# Altium schematic sheet [04] - LEVEL_SHIFTER.SchDoc
size Letter
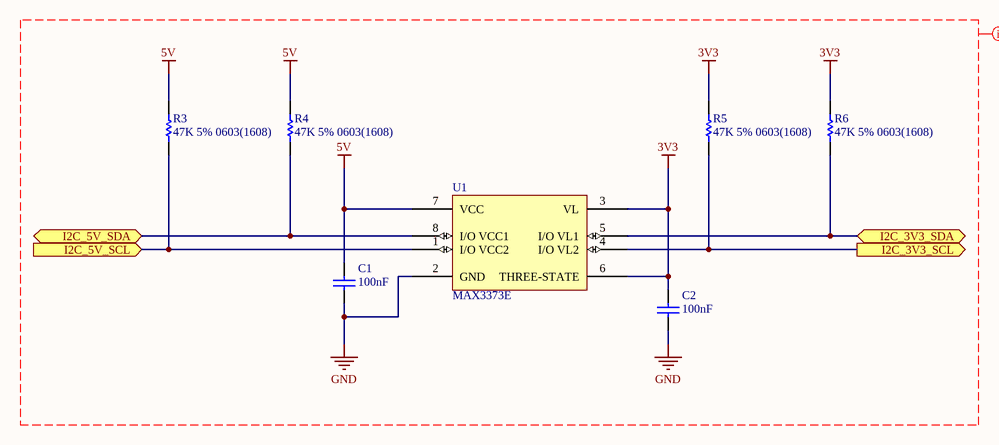
[diagram p0: [04] - LEVEL_SHIFTER.SchDoc]

## Parts
C1  value 100nF  [CAPC0603(1608)100_L]  (hidden comment: CAP 100nF 50V 0603(1608))
C2  value 100nF  [CAPC0603(1608)100_L]  (hidden comment: CAP 100nF 50V 0603(1608))
R3  47K 5% 0603(1608)  [RESC0603(1608)_L]
R4  47K 5% 0603(1608)  [RESC0603(1608)_L]
R5  47K 5% 0603(1608)  [RESC0603(1608)_L]
R6  47K 5% 0603(1608)  [RESC0603(1608)_L]
U1  MAX3373E  [MAX3373E]

## Ports
I2C_3V3_SCL (out), I2C_3V3_SDA (bidir), I2C_5V_SCL (in), I2C_5V_SDA (bidir)

## Nets
3V3: C2.2 R5.1 R6.1 U1.3(VL) U1.6(THREE-STATE)
5V: C1.2 R3.1 R4.1 U1.7(VCC)
GND: C1.1 C2.1 U1.2(GND)
I2C_3V3_SCL: R5.2 U1.4(I/O_VL2) ; port I2C_3V3_SCL
I2C_3V3_SDA: R6.2 U1.5(I/O_VL1) ; port I2C_3V3_SDA
I2C_5V_SCL: R3.2 U1.1(I/O_VCC2) ; port I2C_5V_SCL
I2C_5V_SDA: R4.2 U1.8(I/O_VCC1) ; port I2C_5V_SDA

## Layout directives
net class I2C Level Shifter: 3V3, 5V, GND

## Library data of the parts
C1 C2 = CMP-1035-02592-1: CAP 100nF 50V ±10% 0603 (1608 Metric) Thickness 1mm SMD; Manufacturer Part Number: C0603C104K5RACAUTO; Case-EIA: 0603; Case-Metric: 1608; Max Thickness: 1 mm; Tolerance: ±10%; Technology: SMT; Rated Voltage: 50 V; Digi-key Part Number: 399-6856-1-ND
R3-R6 = CMP-1012-00114-1: 47K 0.1W 5% 0603 (1608 Metric)  SMD; Case-EIA: 0603; Value: 47000.00 Ohm; Case-Metric: 1608; Tolerance: 5 %; Technology: SMT; Power: 0.1 W; Digi-Key Part Number: 311-47KGRCT-ND